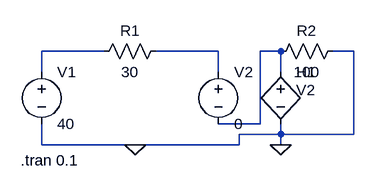
[diagram p0: schematic Draft2.asc]
Draft2.asc, the LTspice schematic file:
Version 4
SHEET 1 880 680
WIRE 48 96 -48 96
WIRE 224 96 128 96
WIRE 320 96 288 96
WIRE 432 96 400 96
WIRE -48 128 -48 96
WIRE 224 128 224 96
WIRE 320 128 320 96
WIRE 288 208 288 96
WIRE 288 208 224 208
WIRE 320 224 320 208
WIRE 320 224 256 224
WIRE 432 224 432 96
WIRE 432 224 320 224
WIRE -48 240 -48 208
WIRE 96 240 -48 240
WIRE 256 240 256 224
WIRE 256 240 96 240
WIRE 320 240 320 224
FLAG 320 240 0
FLAG 96 240 0
SYMBOL voltage -48 112 R0
SYMATTR InstName V1
SYMATTR Value 40
SYMBOL res 144 80 R90
WINDOW 0 0 56 VBottom 2
WINDOW 3 32 56 VTop 2
SYMATTR InstName R1
SYMATTR Value 30
SYMBOL res 416 80 R90
WINDOW 0 0 56 VBottom 2
WINDOW 3 32 56 VTop 2
SYMATTR InstName R2
SYMATTR Value 100
SYMBOL voltage 224 112 R0
WINDOW 123 0 0 Left 2
WINDOW 39 0 0 Left 2
SYMATTR InstName V2
SYMATTR Value 0
SYMBOL h 320 112 R0
WINDOW 3 24 44 Left 2
SYMATTR InstName H1
SYMATTR Value V2
SYMATTR Value2 50
TEXT -80 264 Left 2 !.tran 0.1

The netlist it stands for:
* Draft2.asc
V1 N001 0 40
R1 N002 N001 30
R2 0 N003 100
V2 N002 N003 0
H1 N003 0 V2 50
.tran 0.1
.backanno
.end